# EAGLE schematic ATmega128RFA1-DevBoard (EAGLE 7.5.0)
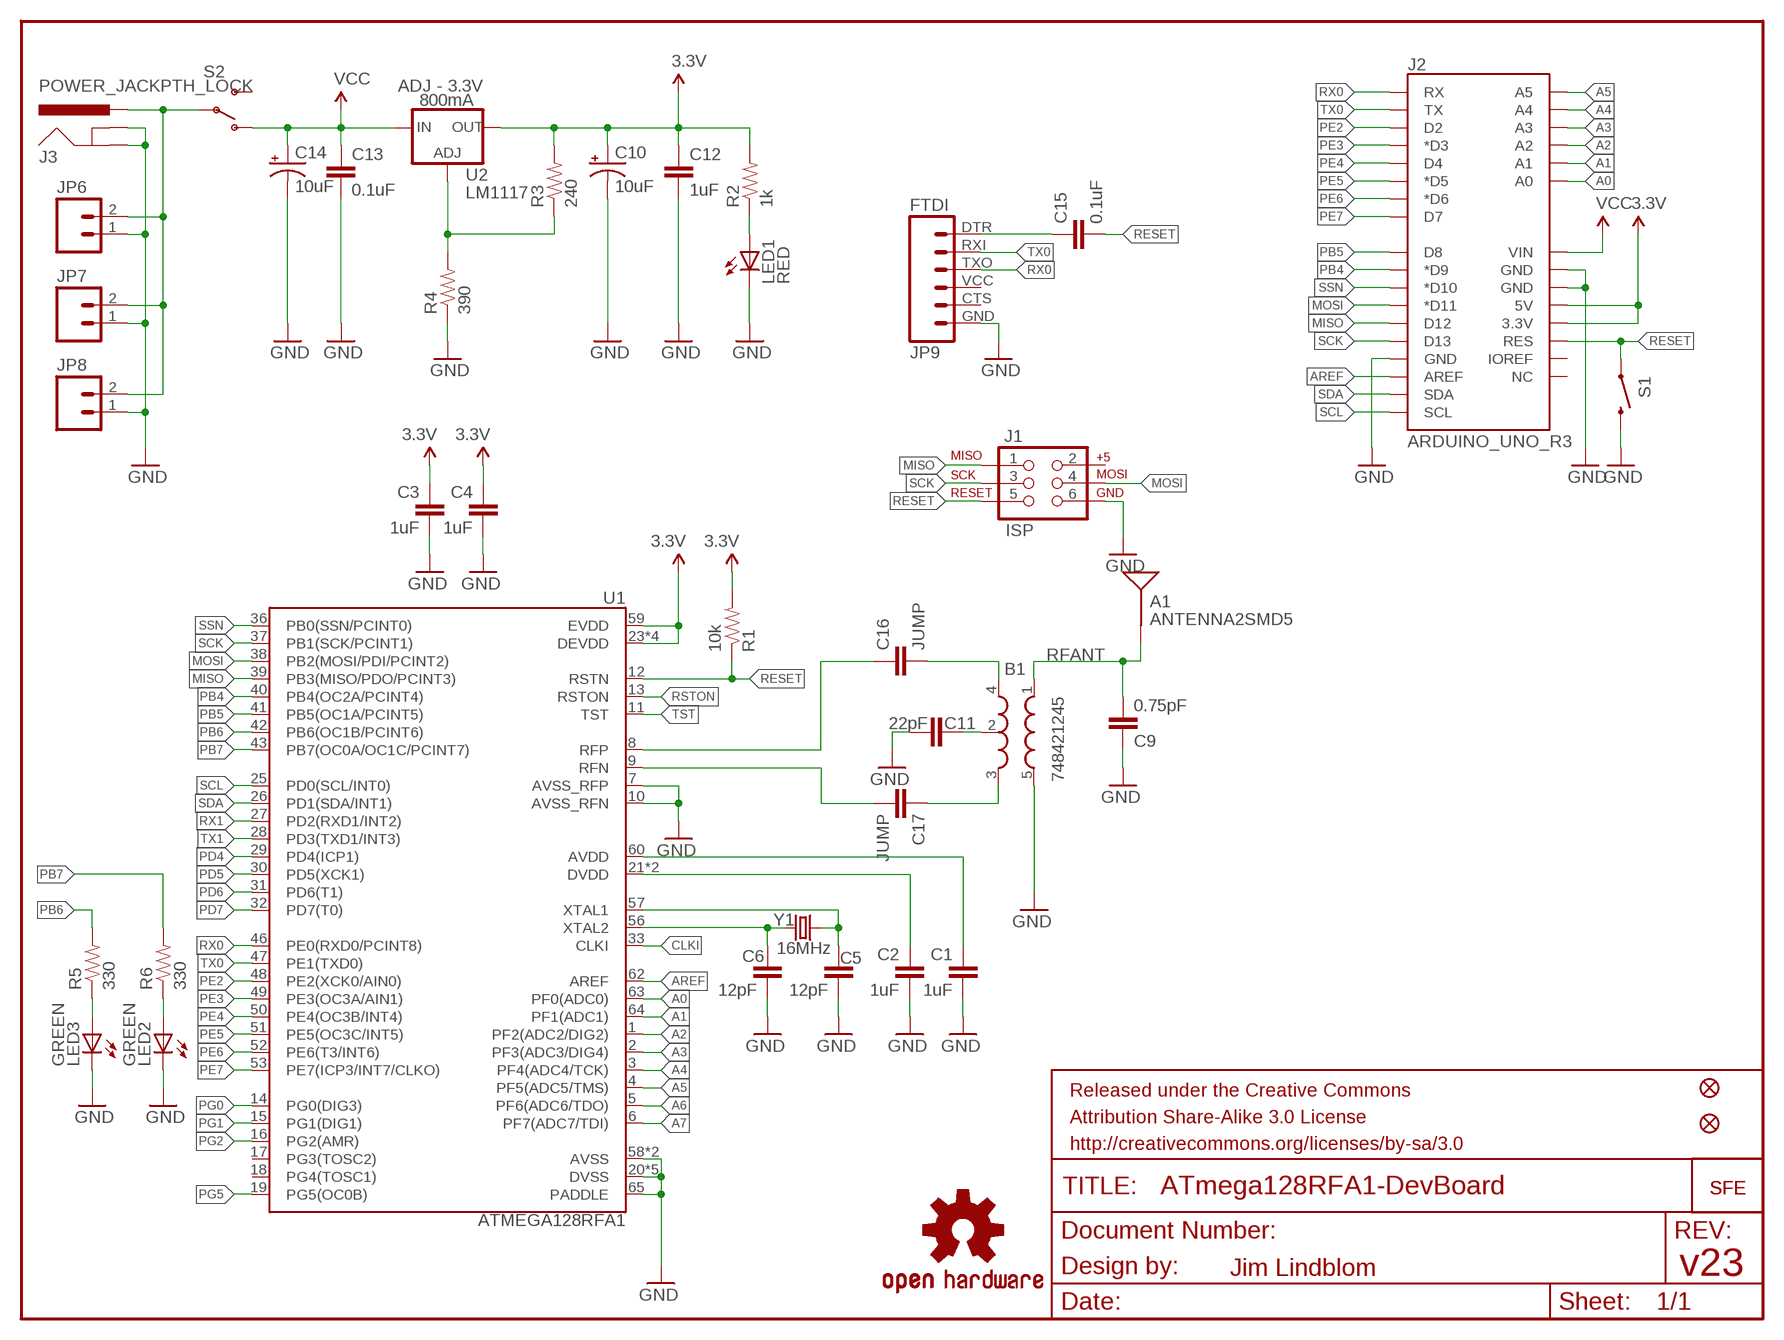
[diagram p0: schematic, sheet 1]

## Parts
A1  ANTENNA2SMD5  [ANTENNA-CHIP5]
B1  748421245  BALUN0805  [BALUN]
C1  1uF  CAP0402-CAP  [0402-CAP]
C2  1uF  CAP0402-CAP  [0402-CAP]
C3  1uF  CAP0402-CAP  [0402-CAP]
C4  1uF  CAP0402-CAP  [0402-CAP]
C5  12pF  CAP0402-CAP  [0402-CAP]
C6  12pF  CAP0402-CAP  [0402-CAP]
C9  0.75pF  CAP0402-CAP  [0402-CAP]
C10  10uF  CAP_POL1206  [EIA3216]
C11  22pF  CAP0402-CAP  [0402-CAP]
C12  1uF  CAP0402-CAP  [0402-CAP]
C13  0.1uF  CAP0402-CAP  [0402-CAP]
C14  10uF  CAP_POL1206  [EIA3216]
C15  0.1uF  CAP0402-CAP  [0402-CAP]
C16  JUMP  CAP0402-CAP  [0402-CAP]
C17  JUMP  CAP0402-CAP  [0402-CAP]
FID1  FIDUCIALUFIDUCIAL  [MICRO-FIDUCIAL]
FID2  FIDUCIALUFIDUCIAL  [MICRO-FIDUCIAL]
J1  ISP  AVR_SPI_PRG_6NS  [2X3-NS]
J2  ARDUINO_UNO_R3  [ARDUINO_UNO_R3]
J3  POWER_JACKPTH_LOCK  [POWER_JACK_PTH_LOCK]
JP4  LOGO-SFENEW  [SFE-NEW-WEBLOGO]
JP6  M02JST-PTH-2  [JST-2-PTH]
JP7  M021X02_NO_SILK  [1X02_NO_SILK]
JP8  M023.5MM-NO_SILK  [SCREWTERMINAL-3.5MM-2-NS]
JP9  FTDI  FTDI_BASICPTH  [FTDI_BASIC]
JP10  LOGO-SFENEW  [SFE-NEW-WEBLOGO]
LED1  RED  LED0603  [LED-0603]
LED2  GREEN  LED0603  [LED-0603]
LED3  GREEN  LED0603  [LED-0603]
R1  10k  RESISTOR0402-RES  [0402-RES]
R2  1k  RESISTOR0402-RES  [0402-RES]
R3  240  RESISTOR0402-RES  [0402-RES]
R4  390  RESISTOR0402-RES  [0402-RES]
R5  330  RESISTOR0402-RES  [0402-RES]
R6  330  RESISTOR0402-RES  [0402-RES]
S1  SWITCH-MOMENTARY-2SMD  [TACTILE_SWITCH_SMD]
S2  SWITCH-SPST-SMD-A  [SWITCH-SPST-SMD-A]
U1  ATMEGA128RFA1  [QFN-64]
U2  LM1117  V_REG_317SMD  [SOT223]
U$1  OSHW-LOGOS  [OSHW-LOGO-S]
Y1  16MHz  CRYSTAL5X3  [CRYSTAL-SMD-5X3]

## Nets
3.3V: C3.1 C4.1 C10.A(+) C12.1 J2.3.3V J2.5V R1.2 R2.2 R3.2 U1.23(DEVDD) U1.34(DEVDD) U1.44(DEVDD) U1.54(DEVDD) U1.59(EVDD) U2.2(OUT)
A0: J2.A0 U1.63(PF0(ADC0))
A1: J2.A1 U1.64(PF1(ADC1))
A2: J2.A2 U1.1(PF2(ADC2/DIG2))
A3: J2.A3 U1.2(PF3(ADC3/DIG4))
A4: J2.A4 U1.3(PF4(ADC4/TCK))
A5: J2.A5 U1.4(PF5(ADC5/TMS))
A6: U1.5(PF6(ADC6/TDO))
A7: U1.6(PF7(ADC7/TDI))
AREF: J2.AREF U1.62(AREF)
AVDD: C1.1 U1.60(AVDD)
CLKI: U1.33(CLKI)
DTR: C15.1 JP9.DTR
DVDD: C2.1 U1.21(DVDD) U1.22(DVDD)
FB: R3.1 R4.2 U2.1(ADJ)
GND: B1.5(GND) C1.2 C2.2 C3.2 C4.2 C5.2 C6.2 C9.1 C10.C(-) C11.2 C12.2 C13.2 C14.C(-) J1.6 J2.GND@0(GND) J2.GND@1(GND) J2.GND@2(GND) J3.GND J3.GNDBREAK JP6.1 JP7.1 JP8.1 JP9.GND LED1.C LED2.C LED3.C R4.1 S1.3 U1.7(AVSS_RFP) U1.10(AVSS_RFN) U1.20(DVSS) U1.24(DVSS) U1.35(DVSS) U1.45(DVSS) U1.55(DVSS) U1.58(AVSS) U1.61(AVSS) U1.65(PADDLE)
MISO: J1.1 J2.D12 U1.39(PB3(MISO/PDO/PCINT3))
MOSI: J1.4 J2.D11(*D11) U1.38(PB2(MOSI/PDI/PCINT2))
N$2: LED1.A R2.1
N$3: C5.1 U1.57(XTAL1) Y1.3
N$4: C6.1 U1.56(XTAL2) Y1.1
N$7: B1.2(GND) C11.1
N$8: LED3.A R5.1
N$9: J3.PWR JP6.2 JP7.2 JP8.2 S2.2(P)
N$10: B1.4(OUT1) C16.2
N$11: B1.3(OUT2) C17.1
N$13: LED2.A R6.1
PB4: J2.D9(*D9) U1.40(PB4(OC2A/PCINT4))
PB5: J2.D8 U1.41(PB5(OC1A/PCINT5))
PB6: R5.2 U1.42(PB6(OC1B/PCINT6))
PB7: R6.2 U1.43(PB7(OC0A/OC1C/PCINT7))
PD4: U1.29(PD4(ICP1))
PD5: U1.30(PD5(XCK1))
PD6: U1.31(PD6(T1))
PD7: U1.32(PD7(T0))
PE2: J2.D2 U1.48(PE2(XCK0/AIN0))
PE3: J2.D3(*D3) U1.49(PE3(OC3A/AIN1))
PE4: J2.D4 U1.50(PE4(OC3B/INT4))
PE5: J2.D5(*D5) U1.51(PE5(OC3C/INT5))
PE6: J2.D6(*D6) U1.52(PE6(T3/INT6))
PE7: J2.D7 U1.53(PE7(ICP3/INT7/CLKO))
PG0: U1.14(PG0(DIG3))
PG1: U1.15(PG1(DIG1))
PG2: U1.16(PG2(AMR))
PG5: U1.19(PG5(OC0B))
RESET: C15.2 J1.5 J2.RES R1.1 S1.1 U1.12(RSTN)
RFANT: A1.FEED(SIGNAL) B1.1(IN) C9.2
RFN: C17.2 U1.9(RFN)
RFP: C16.1 U1.8(RFP)
RSTON: U1.13(RSTON)
RX0: J2.RX JP9.TXO U1.46(PE0(RXD0/PCINT8))
RX1: U1.27(PD2(RXD1/INT2))
SCK: J1.3 J2.D13 U1.37(PB1(SCK/PCINT1))
SCL: J2.SCL U1.25(PD0(SCL/INT0))
SDA: J2.SDA U1.26(PD1(SDA/INT1))
SSN: J2.D10(*D10) U1.36(PB0(SSN/PCINT0))
TST: U1.11(TST)
TX0: J2.TX JP9.RXI U1.47(PE1(TXD0))
TX1: U1.28(PD3(TXD1/INT3))
VCC: C13.1 C14.A(+) J2.VIN S2.1(O) U2.3(IN)
Unconnected: J1.2 J2.IOREF J2.NC JP9.CTS JP9.VCC S2.3(S) U1.17(PG3(TOSC2)) U1.18(PG4(TOSC1))

## Notes on the sheet
- ADJ - 3.3V
- 800mA
- Jim Lindblom | v23

## Library data of the parts
A1 = SparkFun-RF:ANTENNA2: Chip antenna Single endded antenna. Common with smaller chip antennas. CHIP4 package is the GPS Chip Antenna SKU: GPS-08418. CHIP5 package is 2.4GHz chip antenna SKU: WRL-00144.
B1 = SparkFun-RF:BALUN: 0805 footprint balun- Ember 351/357
C1-C6 C9 C11-C13 C15 = SparkFun-Passives:CAP: Capacitor Standard 0603 ceramic capacitor, and 0.1" leaded capacitor.
C10 C14 = SparkFun-Passives:CAP_POL: Capacitor Polarized These are standard SMD and PTH capacitors. Normally 10uF, 47uF, and 100uF in electrolytic and tantalum varieties. Always verify the external diameter of the through hole cap, it varies with capacity, voltage, and manufacturer. The EIA devices should be standard.
C16 C17 = SparkFun:CAP: Capacitor Standard 0603 ceramic capacitor, and 0.1" leaded capacitor.
FID1 FID2 = SparkFun-Aesthetics:FIDUCIAL: Fiducial Alignment Points Various fiducial points for machine vision alignment.
J1 = SparkFun-Connectors:AVR_SPI_PRG_6: AVR ISP 6 Pin This is the reduced ISP connector for AVR programming. Common on Arduino. This footprint will take up less PCB space and can be used with a 10-pin to 6-pin adapter such as SKU: BOB-08508
J2 = SparkFun-Boards:ARDUINO_UNO_R3: Arduino Uno R3 This includes the two extra pins on the 8-AREF header (SDA and SCL), as well as the 2 extra pins on the power header (IOREF and NC).
J3 = SparkFun-Connectors:POWER_JACK: Power Jack This is the standard 5.5mm barrel jack for power. The PTH is the most common, proven, reliable, footprint. The Slot footprint only works if the mill layer is transmitted to the PCB fab house so be warned. Spark Fun Electronics SKU : PRT-00119 SMT: CONN-08106 Mating wall wart : TOL-00298 (and others)
JP4 JP10 = SparkFun-Aesthetics:LOGO-SFE: Spark Fun Electronics PCB Logo This is the standard Spark Fun Electronics PCB logo.
JP6-JP8 = SparkFun-Connectors:M02: Header 2 Standard 2-pin 0.1" header. Use with straight break away headers (SKU : PRT-00116), right angle break away headers (PRT-00553), swiss pins (PRT-00743), machine pins (PRT-00117), and female headers (PRT-00115). Molex polarized connector foot print use with SKU : PRT-08233 with associated crimp pins and housings.
JP9 = SparkFun-Connectors:FTDI_BASIC: FTDI Basic header with labels
LED1-LED3 = SparkFun-LED:LED: LEDs Standard schematic elements and footprints for 5mm, 3mm, 1206, and 0603 sized LEDs. 5mm - Spark Fun Electronics SKU : COM-00529 (and others)
R1 R2 = SparkFun-Passives:RESISTOR: Resistor Basic schematic elements and footprints for 0603, 1206, and PTH resistors.
R3-R6 = SparkFun:RESISTOR: Resistor Basic schematic elements and footprints for 0603, 1206, and PTH resistors.
S1 = SparkFun-Electromechanical:SWITCH-MOMENTARY-2: Various NO switches- pushbuttons, reed, etc
S2 = SparkFun:SWITCH-SPST: SPST Switch Simple slide switch. Spark Fun Electronics SKU : COM-00102
U1 = SparkFun-DigitalIC:ATMEGA128RFA1: ATmega128RFA1 8-bit AVR Microcontroller with Low Power 2.4GHz Transceiver for ZigBee and IEEE 802.15.4
U2 = SparkFun:V_REG_317: Voltage Regulator Standard LM317 adjustable voltage regulator. AOI (Adjust Output Input). Google 'LM317 Calculator' for easy to use app to get the two resistor values needed. 240/720 for 5V output. 240/390 for 3.3V output. Spark Fun Electronics SKU : COM-00527
U$1 = SparkFun-Aesthetics:OSHW-LOGO: Open Source Hardware Logo This logo indicates the piece of hardware it is found on incorporates a OSHW license and/or adheres to the definition of open source hardware found here: http://freedomdefined.org/OSHW
Y1 = SparkFun-FreqCtrl:CRYSTAL: Various standard crystals. Proven footprints. Spark Fun Electronics SKU : COM-00534